# EAGLE schematic sch1 (EAGLE 8.6.3)
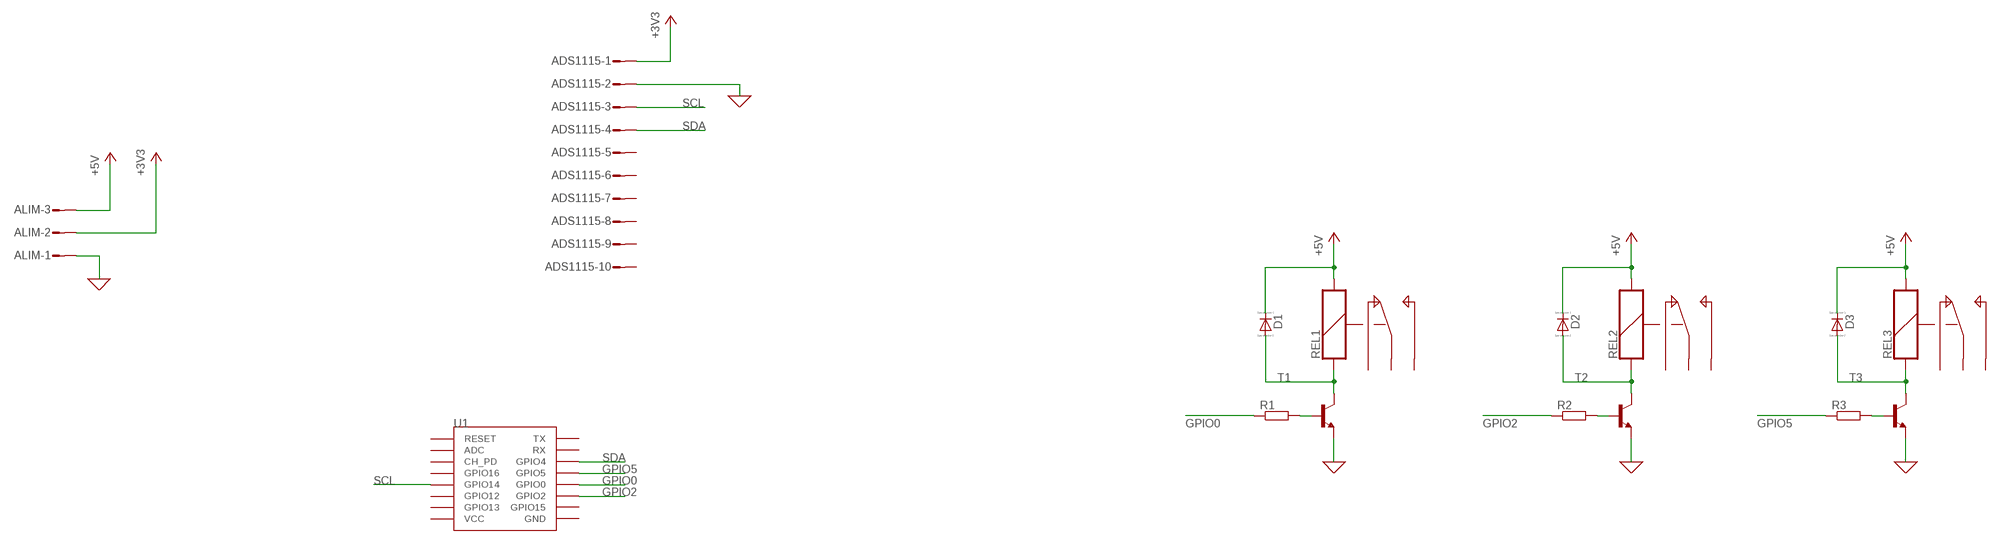
[diagram p0: schematic, sheet 1]

## Parts
ADS1115  S10P  [S10P]
ALIM  S03P  [S03P]
D1  DIODE_E-  [DIODE_SMB]
D2  DIODE_E-  [DIODE_SMB]
D3  DIODE_E-  [DIODE_SMB]
R1  R-EU_M0805  [M0805]
R2  R-EU_M0805  [M0805]
R3  R-EU_M0805  [M0805]
REL1  REL-5PIN  [REL-5PIN]
REL2  REL-5PIN  [REL-5PIN]
REL3  REL-5PIN  [REL-5PIN]
T1  BC817-NPN-SOT23-BEC  [SOT23-BEC]
T2  BC817-NPN-SOT23-BEC  [SOT23-BEC]
T3  BC817-NPN-SOT23-BEC  [SOT23-BEC]
U1  ESP12SMD  [ESP12-SMD]

## Nets
0: ADS1115.2 ALIM.1 T1.E T2.E T3.E ; supply symbol labelled GND
+3V3: ADS1115.1 ALIM.2
+5V: ALIM.3 D1.C(A) D2.C(A) D3.C(A) REL1.S2 REL2.S2 REL3.S2
GPIO0: R1.1 U1.GPIO0
GPIO2: R2.1 U1.GPIO2
GPIO5: R3.1 U1.GPIO5
N$1: D1.A(C) REL1.S1 T1.C
N$2: D2.A(C) REL2.S1 T2.C
N$3: R1.2 T1.B
N$4: R2.2 T2.B
N$5: D3.A(C) REL3.S1 T3.C
N$6: R3.2 T3.B
SCL: ADS1115.3 U1.GPIO14
SDA: ADS1115.4 U1.GPIO4
Unconnected: ADS1115.5 ADS1115.6 ADS1115.7 ADS1115.8 ADS1115.9 ADS1115.10 REL1.C REL1.O REL1.S REL2.C REL2.O REL2.S REL3.C REL3.O REL3.S U1.ADC U1.CH_PD U1.GND U1.GPIO12 U1.GPIO13 U1.GPIO15 U1.GPIO16 U1.RESET U1.RXD0(RX) U1.TXD0(TX) U1.VCC

## Library data of the parts
ADS1115 = con-amp-mt:S10P: AMP MT CONNECTOR; OC_FARNELL: unknown; OC_NEWARK: unknown
ALIM = con-amp-mt:S03P: AMP MT CONNECTOR; OC_FARNELL: unknown; OC_NEWARK: unknown
D1-D3 = eagle-ltspice:DIODE_E-: Schottky Diode; SPICEMODEL: diode; SPICEPREFIX: D
R1-R3 = resistor:R-EU_: RESISTOR, European symbol
REL1-REL3 = special:REL-5PIN: RELAY
T1-T3 = transistor:*-NPN-: NPN Transistror BF959 corrected 2008.03.06
U1 = esp8266modules:ESP12: ESP8266 Wifi module 12